# EAGLE schematic cicuit_shield (EAGLE 9.6.2)
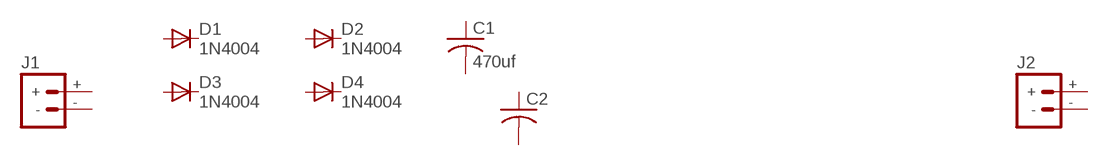
[diagram p0: schematic, sheet 1]

## Parts
C1  470uf  C-US025-025X050  [C025-025X050]
C2  C-US025-025X050  [C025-025X050]
D1  1N4004  [DO41-10]
D2  1N4004  [DO41-10]
D3  1N4004  [DO41-10]
D4  1N4004  [DO41-10]
J1  BATTERY_CONN_DEANS  [DEANS]
J2  BATTERY_CONN_DEANS  [DEANS]
Unconnected: C1.1 C1.2 C2.1 C2.2 D1.A D1.C D2.A D2.C D3.A D3.C D4.A D4.C J1.+ J1.- J2.+ J2.-

## Library data of the parts
C1 C2 = adafruit:C-US: CAPACITOR, American symbol
D1-D4 = adafruit:1N4004: DIODE General purpose 1N400x type rectifier (With bigger pads) http://www.ladyada.net/library/pcb/eaglelibrary.html
J1 J2 = SparkFun-Connectors:BATTERY_CONN: Battery Connectors Various footprints for battery connections SparkFun Products: Deans Connector -M/F Pair <https://www.sparkfun.com/products/11864>; SF_ID: PRT-11864